# EAGLE design CC3000_Breakout (EAGLE 6.4)
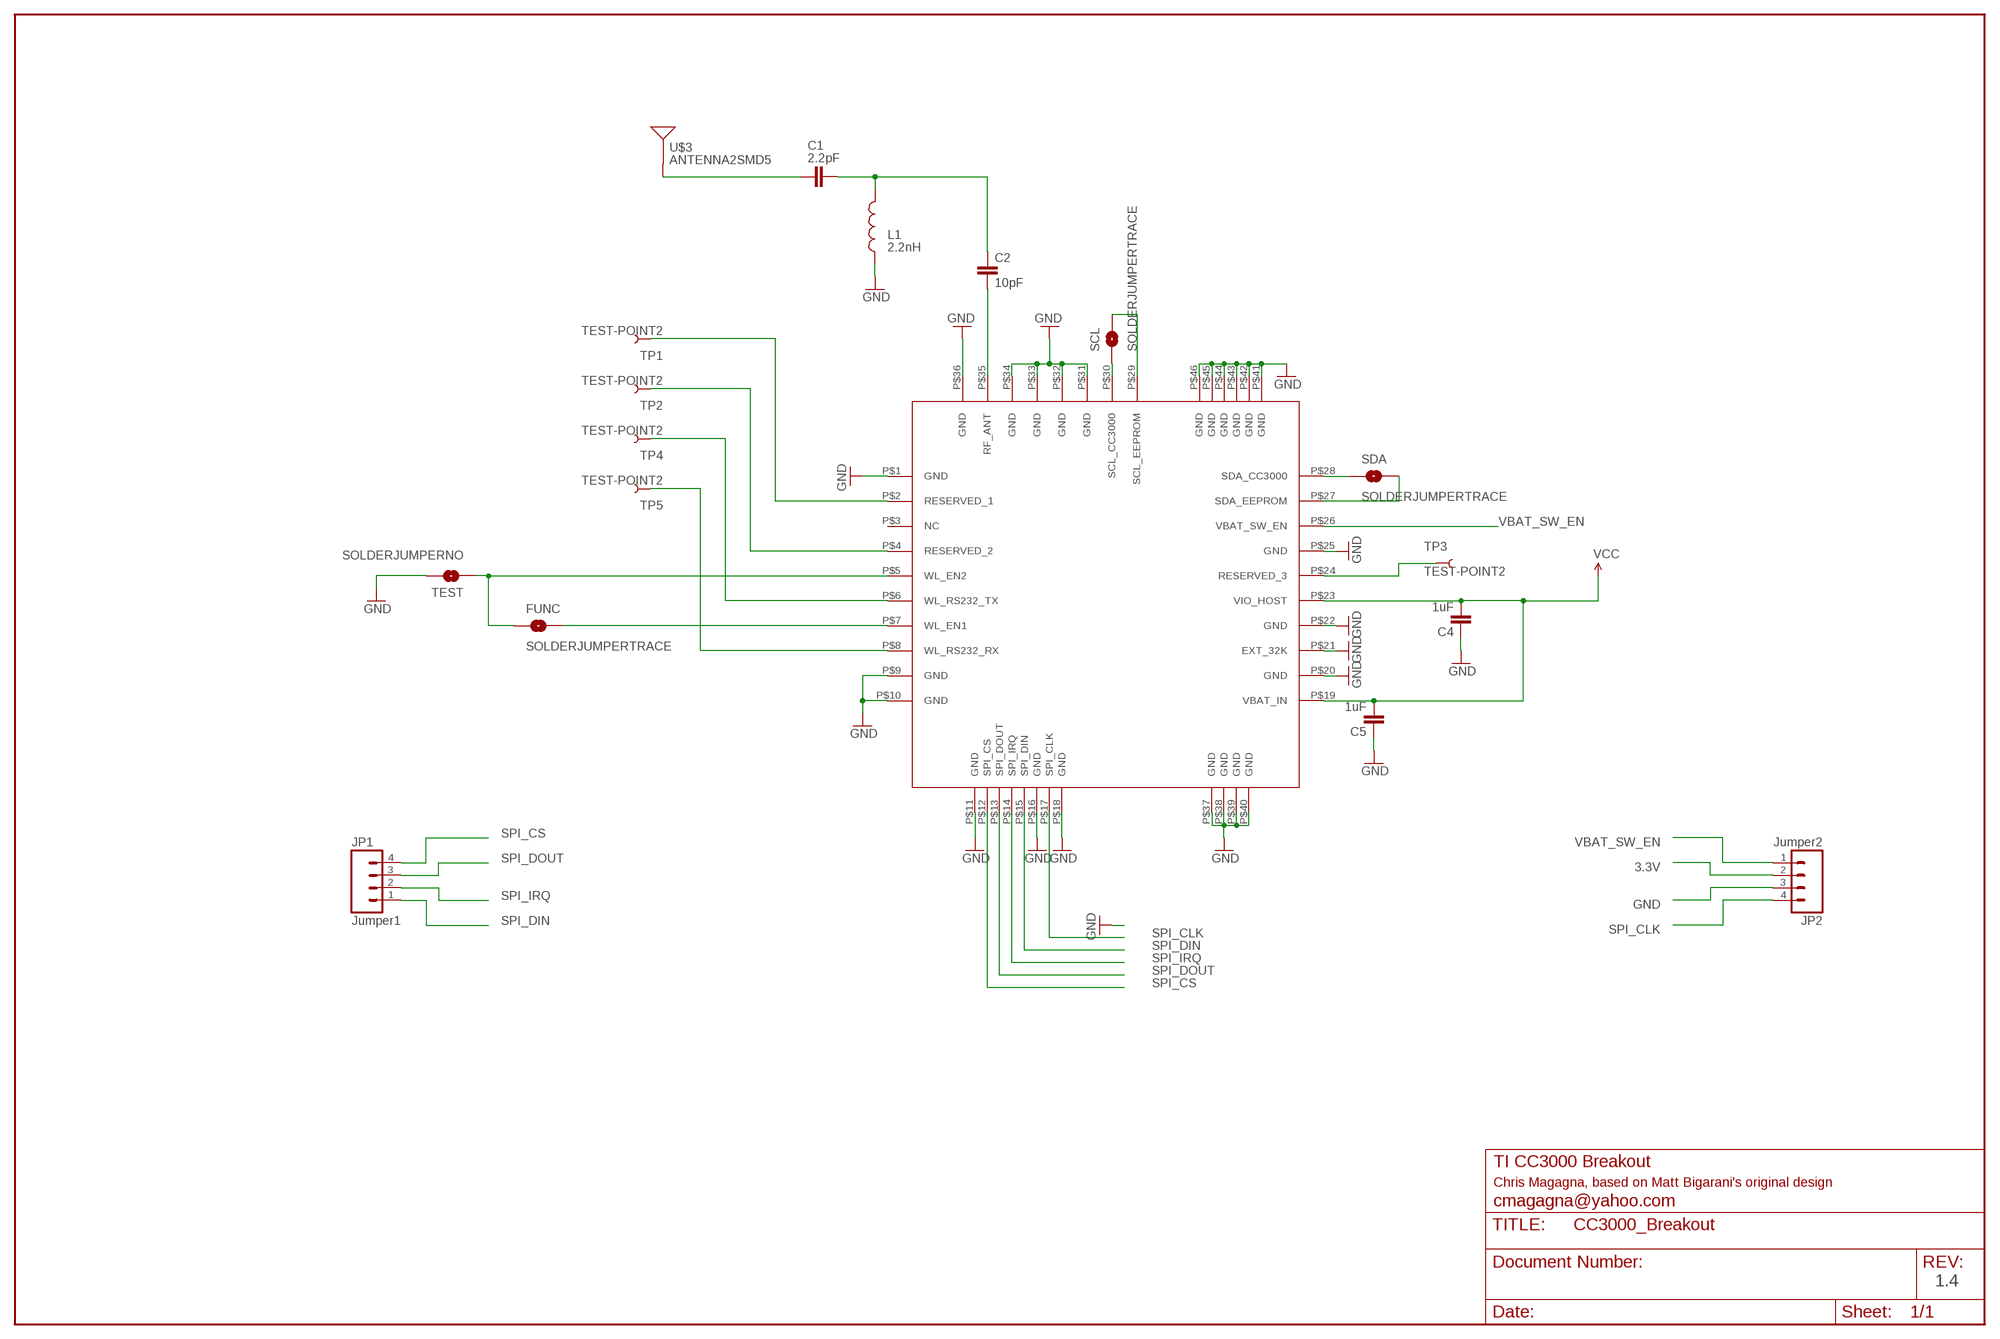
[diagram p0: schematic, sheet 1]

## Parts
C1  2.2pF  CAP0402-CAP  [0402-CAP]
C2  10pF  CAP0402-CAP  [0402-CAP]
C4  1uF  CAP0402-CAP  [0402-CAP]
C5  1uF  CAP0402-CAP  [0402-CAP]
FUNC  SOLDERJUMPERTRACE  [SJ_2S-TRACE]
JP1  Jumper1  M04PTH  [1X04]
JP2  Jumper2  M04PTH  [1X04]
L1  2.2nH  INDUCTOR0402  [C0402]
SCL  SOLDERJUMPERTRACE  [SJ_2S-TRACE]
SDA  SOLDERJUMPERTRACE  [SJ_2S-TRACE]
TEST  SOLDERJUMPERNO  [SJ_2S-NO]
TP1  TEST-POINT2  [PAD.02X.02]
TP2  TEST-POINT2  [PAD.02X.02]
TP3  TEST-POINT2  [PAD.02X.02]
TP4  TEST-POINT2  [PAD.02X.02]
TP5  TEST-POINT2  [PAD.02X.02]
U$1  CC3000  [CC3000]
U$3  ANTENNA2SMD5  [ANTENNA-CHIP5]

## Nets
3.3V [vcc]: C4.2 C5.2 JP2.2 U$1.P$19(VBAT_IN) U$1.P$23(VIO_HOST) ; supply symbol labelled VCC
GND: C4.1 C5.1 JP2.3 L1.1 TEST.2 U$1.P$1(GND) U$1.P$9(GND) U$1.P$10(GND) U$1.P$11(GND) U$1.P$16(GND) U$1.P$18(GND) U$1.P$20(GND) U$1.P$21(EXT_32K) U$1.P$22(GND) U$1.P$25(GND) U$1.P$31(GND) U$1.P$32(GND) U$1.P$33(GND) U$1.P$34(GND) U$1.P$36(GND) U$1.P$37(GND) U$1.P$38(GND) U$1.P$39(GND) U$1.P$40(GND) U$1.P$41(GND) U$1.P$42(GND) U$1.P$43(GND) U$1.P$44(GND) U$1.P$45(GND) U$1.P$46(GND)
N$1: FUNC.2 U$1.P$7(WL_EN1)
N$2: FUNC.1 TEST.1 U$1.P$5(WL_EN2)
N$3 [1.8v]: TP1.P$1 U$1.P$2(RESERVED_1)
N$4 [1.8v]: TP2.P$1 U$1.P$4(RESERVED_2)
N$5 [1.8v]: TP4.P$1 U$1.P$6(WL_RS232_TX)
N$6 [1.8v]: TP5.P$1 U$1.P$8(WL_RS232_RX)
N$7 [1.8v]: TP3.P$1 U$1.P$24(RESERVED_3)
N$10 [antenna]: C1.2 C2.1 L1.2
N$13 [antenna]: C2.2 U$1.P$35(RF_ANT)
N$14 [1.8v]: SCL.1 U$1.P$30(SCL_CC3000)
N$15 [antenna]: C1.1 U$3.FEED(SIGNAL)
N$16 [1.8v]: SCL.2 U$1.P$29(SCL_EEPROM)
N$17 [1.8v]: SDA.1 U$1.P$28(SDA_CC3000)
N$18 [1.8v]: SDA.2 U$1.P$27(SDA_EEPROM)
SPI_CLK: JP2.4 U$1.P$17(SPI_CLK)
SPI_CS: JP1.4 U$1.P$12(SPI_CS)
SPI_DIN: JP1.1 U$1.P$15(SPI_DIN)
SPI_DOUT: JP1.3 U$1.P$13(SPI_DOUT)
SPI_IRQ: JP1.2 U$1.P$14(SPI_IRQ)
VBAT_SW_EN: JP2.1 U$1.P$26(VBAT_SW_EN)
Unconnected: U$1.P$3(NC)

## Notes on the sheet
- TI CC3000 Breakout
- Chris Magagna, based on Matt Bigarani's original design
- cmagagna@yahoo.com
- 1.4

## Library data of the parts
C1 C2 C4 C5 = SparkFun:CAP: Capacitor Standard 0603 ceramic capacitor, and 0.1" leaded capacitor.
FUNC SCL SDA = SparkFun-Passives:SOLDERJUMPER: Solder Jumper Standard SMD solder jumper. Used to automate production. Two varients : Normally Open and Normally Closed are the same, but have different paste layers. NC will have a large amount of paste and should jumper during reflow.
JP1 JP2 = SparkFun-Connectors:M04: Header 4 Standard 4-pin 0.1" header. Use with straight break away headers (SKU : PRT-00116), right angle break away headers (PRT-00553), swiss pins (PRT-00743), machine pins (PRT-00117), and female headers (PRT-00115). Molex polarized connector foot print use with SKU : PRT-08231 with associated crimp pins and housings. 1MM SMD Version SKU: PRT-10208
L1 = SparkFun:INDUCTOR: Inductors Basic Inductor/Choke - 0603 and 1206. Footprints are not proven and vary greatly between part numbers.
TEST = SparkFun:SOLDERJUMPER: Solder Jumper Standard SMD solder jumper. Used to automate production. Two varients : Normally Open and Normally Closed are the same, but have different paste layers. NC will have a large amount of paste and should jumper during reflow.
TP1-TP5 = SparkFun-Passives:TEST-POINT: Bare copper test points for troubleshooting or ICT
U$1 = centerblack_engineering:CC3000: TI SimpleLink CC3000 Module - WiFi 802.11b/g Network Processor; AUTHOR: Matt Bigarani; DATASHEET: http://www.ti.com/lit/ds/symlink/cc3000.pdf; DATE: 2/8/2013
U$3 = SparkFun-RF-Modified:ANTENNA2: Chip antenna Single endded antenna. Common with smaller chip antennas. CHIP4 package is the GPS Chip Antenna SKU: GPS-08418. CHIP5 package is 2.4GHz chip antenna SKU: WRL-00144.

## Net classes
0 default: width 0.203 mm, clearance 0.203 mm
1 vcc: width 1.016 mm, clearance 0.203 mm
2 antenna: width 0.95 mm, clearance 0.152 mm
3 1.8v: width 0.457 mm, clearance 0.254 mm

## Board
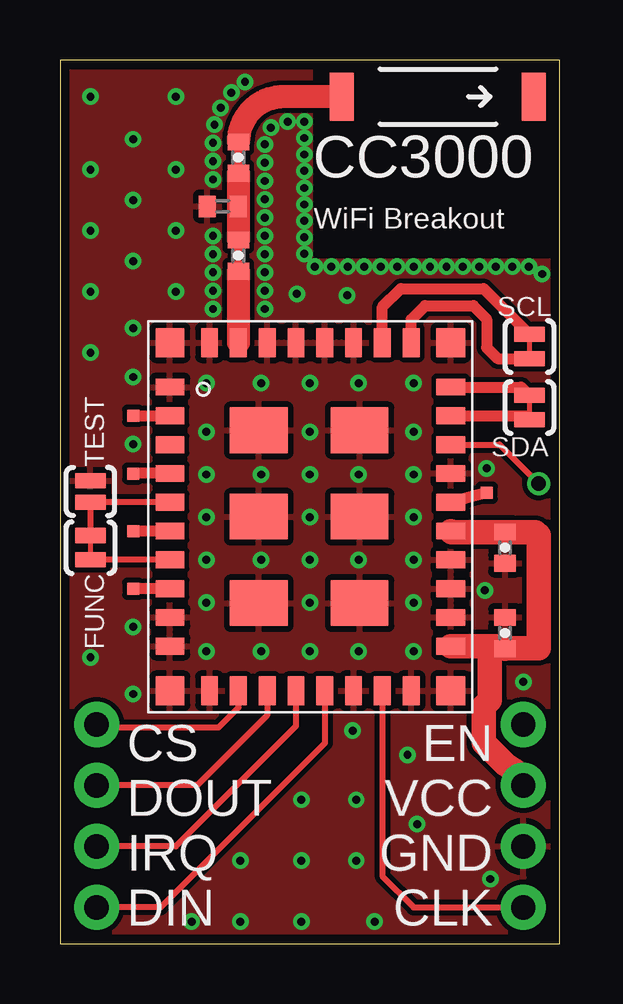
[diagram p1: board, top side]
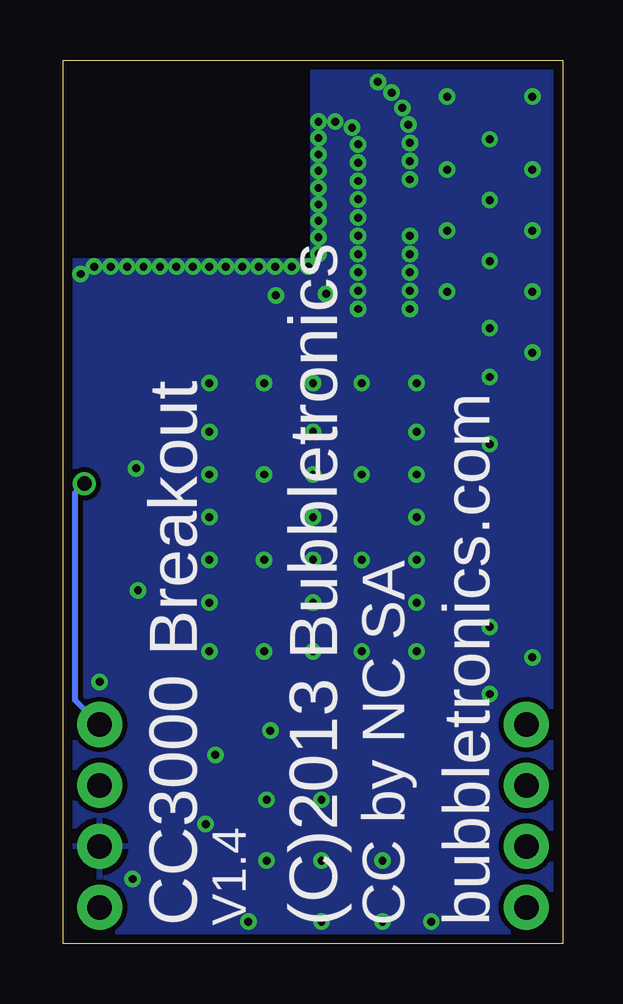
[diagram p2: board, bottom side, seen from below]

Size 20.83 x 36.83 mm. Coordinates in mm from the lower left corner, seen from the top.
Outline: 0,0 20.83,0 20.83,36.83 0,36.83 0,0
Copper layers (1*16): Top 0.035mm / dielectric 1.5mm / Bottom 0.035mm
Design rules "Meets both ITEADStudio and Osh Park": minimum track width 6mil, minimum drill 13mil, track to track 6mil, track to pad 6mil, pad to pad 6mil, via to via 6mil, smd to smd 6mil, copper to edge 15mil, drill to drill 10mil, minimum pad ring 10mil, minimum via ring 7mil, stop-mask expansion 4mil, vias tented up to drill 100mil, thermal gap 10mil

### Footprints (pad centres in the part's own frame; a part is rotated, then mirrored left to right if it is on the bottom)
0402-CAP = smd 0.7 x 0.9: 1 -0.65,0; 2 0.65,0
SJ_2S-TRACE = smd 0.635 x 1.27: 1 -0.508,0; 2 0.508,0
1X04 = drill 1.016 pad 1.88: 1 0,0; 2 2.54,0; 3 5.08,0; 4 7.62,0
C0402 = smd 0.7 x 0.9: 1 -0.65,0; 2 0.65,0
SJ_2S-NO = smd 0.635 x 1.27: 1 -0.45,0; 2 0.45,0
PAD.02X.02 = smd 0.508 x 0.508: P$1 0,0
CC3000 = smd 1.2 x 0.7: P$1 0.9,13.55; P$2 0.9,12.35; P$3 0.9,11.15; P$4 0.9,9.95; P$5 0.9,8.75; P$6 0.9,7.55; P$7 0.9,6.35; P$8 0.9,5.15; P$9 0.9,3.95; P$10 0.9,2.75; P$19 12.6,2.75; P$20 12.6,3.95; P$21 12.6,5.15; P$22 12.6,6.35; P$23 12.6,7.55; P$24 12.6,8.75; P$25 12.6,9.95; P$26 12.6,11.15; P$27 12.6,12.35; P$28 12.6,13.55 | smd 0.7 x 1.2: P$11 2.55,0.9; P$12 3.75,0.9; P$13 4.95,0.9; P$14 6.15,0.9; P$15 7.35,0.9; P$16 8.55,0.9; P$17 9.75,0.9; P$18 10.95,0.9; P$29 10.95,15.4; P$30 9.75,15.4; P$31 8.55,15.4; P$32 7.35,15.4; P$33 6.15,15.4; P$34 4.95,15.4; P$35 3.75,15.4; P$36 2.55,15.4 | smd 2.4 x 1.9: P$37 4.6,11.75; P$38 4.6,8.15; P$39 4.6,4.55; P$40 8.8,11.75; P$41 8.8,8.15; P$42 8.8,4.55 | smd 1.2 x 1.2: P$43 0.9,15.4; P$44 0.9,0.9; P$45 12.6,0.9; P$46 12.6,15.4
ANTENNA-CHIP5 = smd 1 x 2: FEED -4,0; NC 4,0

### Placement (x,y rotation side)
C1  7.43,32.77 270 top
C2  7.43,28.68 270 top
C4  18.54,16.51 90 top
C5  18.54,12.95 270 top
FUNC  1.27,16.51 270 top
JP1  1.52,1.52 90 top
JP2  19.3,9.14 270 top
L1  6.78,30.73 0 top
SCL  19.56,24.89 270 top
SDA  19.56,22.35 270 top
TEST  1.27,18.85 90 top
TP1  3.05,22.01 0 top
TP2  3.05,19.6 0 top
TP3  17.78,18.8 0 top
TP4  3.05,17.2 0 top
TP5  3.05,14.8 0 top
U$1  3.68,9.65 0 top
U$3  15.75,35.31 0 top

### Tracks (layer width: path | path; a pad name or v marks a point on that pad's centre or on a via)
3.3V
  Top 1.016: U$1.P$23 16.32,17.16 C4.2 18.92,17.14 19.81,17.14 19.94,17.02 19.94,12.32 18.92,12.32 C5.2 18.44,12.4 17.91,12.4 | U$1.P$19 17.91,12.4 | 17.91,12.4 17.91,10.16 17.65,9.91 17.65,8.38 18.54,7.49 18.92,7.24 19.3,6.86 JP2.2
GND  (via drill 0.33 pad 0.03)
  other vias: 10.19,29.44 10.19,31.5 10.19,32.89 10.19,32.21 10.19,30.81 10.19,30.12 10.19,34.26 10.19,33.58 10.19,28.75 10.62,28.22 11.3,28.22 11.99,28.22 12.67,28.22 13.36,28.22 14.05,28.22 14.73,28.22 15.42,28.22 16.1,28.22 16.79,28.22 17.48,28.22 18.16,28.22 18.85,28.22 19.53,28.22 20.09,27.91 10.41,23.37 12.45,23.37 14.73,23.37 14.73,14.22 6.1,14.22 8.38,23.37 6.1,17.78 6.1,23.37 6.1,19.56 1.27,11.94 8.38,19.56 3.05,20.83 10.41,19.56 12.45,19.56 3.05,13.21 14.73,19.56 14.73,16 17.78,19.81 12.45,16 10.41,16 10.41,14.22 8.38,16 1.27,24.64 6.1,16 3.05,10.41 6.1,12.19 8.38,12.19 10.41,12.19 3.05,23.62 12.45,12.19 3.05,25.65 14.73,12.19 6.1,21.34 10.41,21.34 10.41,17.78 14.73,17.78 14.73,21.34 9.87,27.09 11.96,27.03 12.19,8.89 10.06,6.01 12.34,6.01 7.52,3.47 10.06,3.47 12.34,3.47 5.49,0.93 7.52,0.93 10.06,0.93 13.11,0.93 19.3,10.92 1.27,27.18 3.05,28.45 3.05,30.99 3.05,33.53 1.27,29.72 1.27,32.26 1.27,35.31 4.83,35.31 4.83,27.18 4.83,32.26 4.83,29.72 17.7,14.73 14.48,7.87 14.88,4.99 17.93,2.71 9.49,34.26 8.79,34.01 8.53,33.31 8.53,32.55 8.53,31.79 8.53,31.03 8.53,30.26 8.53,29.5 8.53,28.74 8.53,27.98 8.53,27.22 8.53,26.45 6.38,26.45 6.38,27.22 6.38,27.98 6.38,28.74 6.38,29.5 6.38,31.85 6.38,32.61 6.38,33.38 6.44,34.14 6.69,34.84 7.14,35.47 7.71,35.92
  pour Top: 0,0 0,36.83 2.54,36.83 2.54,36.8 10.41,36.8 10.41,28.45 20.83,28.45 20.83,0
  pour Bottom: 0,0 0,36.83 10.41,36.83 10.41,28.45 20.83,28.45 20.83,0
N$1
  Top 0.254: U$1.P$7 FUNC.2
N$2
  Top 0.254: U$1.P$5 TEST.1 FUNC.1
N$3
  Top 0.457: TP1.P$1 U$1.P$2
N$4
  Top 0.457: U$1.P$4 TP2.P$1
N$5
  Top 0.457: U$1.P$6 TP4.P$1
N$6
  Top 0.457: U$1.P$8 TP5.P$1
N$7
  Top 0.457: TP3.P$1 U$1.P$24
N$10
  Top 0.95: C1.2 L1.2 arc90 L1.2 C2.1 arc-90 C2.1
N$13
  Top 0.95: C2.2 U$1.P$35 arc90 U$1.P$35
N$14
  Top 0.457: U$1.P$30 13.43,26.54 14.2,27.3 17.65,27.3 SCL.1
N$15
  Top 0.95: U$3.FEED 9.32,35.31 arc90 C1.1
N$16
  Top 0.457: U$1.P$29 14.63,26.01 15.21,26.59 17.22,26.59 17.78,26.04 17.78,24.84 18.24,24.38 SCL.2
N$17
  Top 0.457: U$1.P$28 19.22,23.2 SDA.1
N$18
  Top 0.254: 19.56,22 SDA.2
  Top 0.457: U$1.P$27 19.4,22 SDA.2
SPI_CLK
  Top 0.254: U$1.P$17 13.43,2.82 14.73,1.52 JP2.4
SPI_CS
  Top 0.254: U$1.P$12 7.43,9.85 6.6,9.02 1.65,9.02 JP1.4
SPI_DIN
  Top 0.254: U$1.P$15 11.03,8.37 4.19,1.52 JP1.1
SPI_DOUT
  Top 0.254: U$1.P$13 8.63,9.52 5.71,6.6 JP1.3
SPI_IRQ
  Top 0.254: U$1.P$14 9.83,9.07 4.83,4.06 JP1.2
VBAT_SW_EN  (via drill 0.6)
  Top 0.254: U$1.P$26 18.31,20.8 v19.94,19.18
  Bottom 0.254: JP2.1 20.32,10.16 20.32,18.8 v19.94,19.18

### Text on the board
tNames: CC3000 | WiFi Breakout | EN | CS | VCC | DOUT | GND | IRQ | CLK | DIN
bNames: bubbletronics.com | CC by NC SA | (C)2013 Bubbletronics | V1.4 | CC3000 Breakout